# Altium schematic sheet Buttons.SchDoc
size A4; SheetNumber: 2; SheetTotal: 2
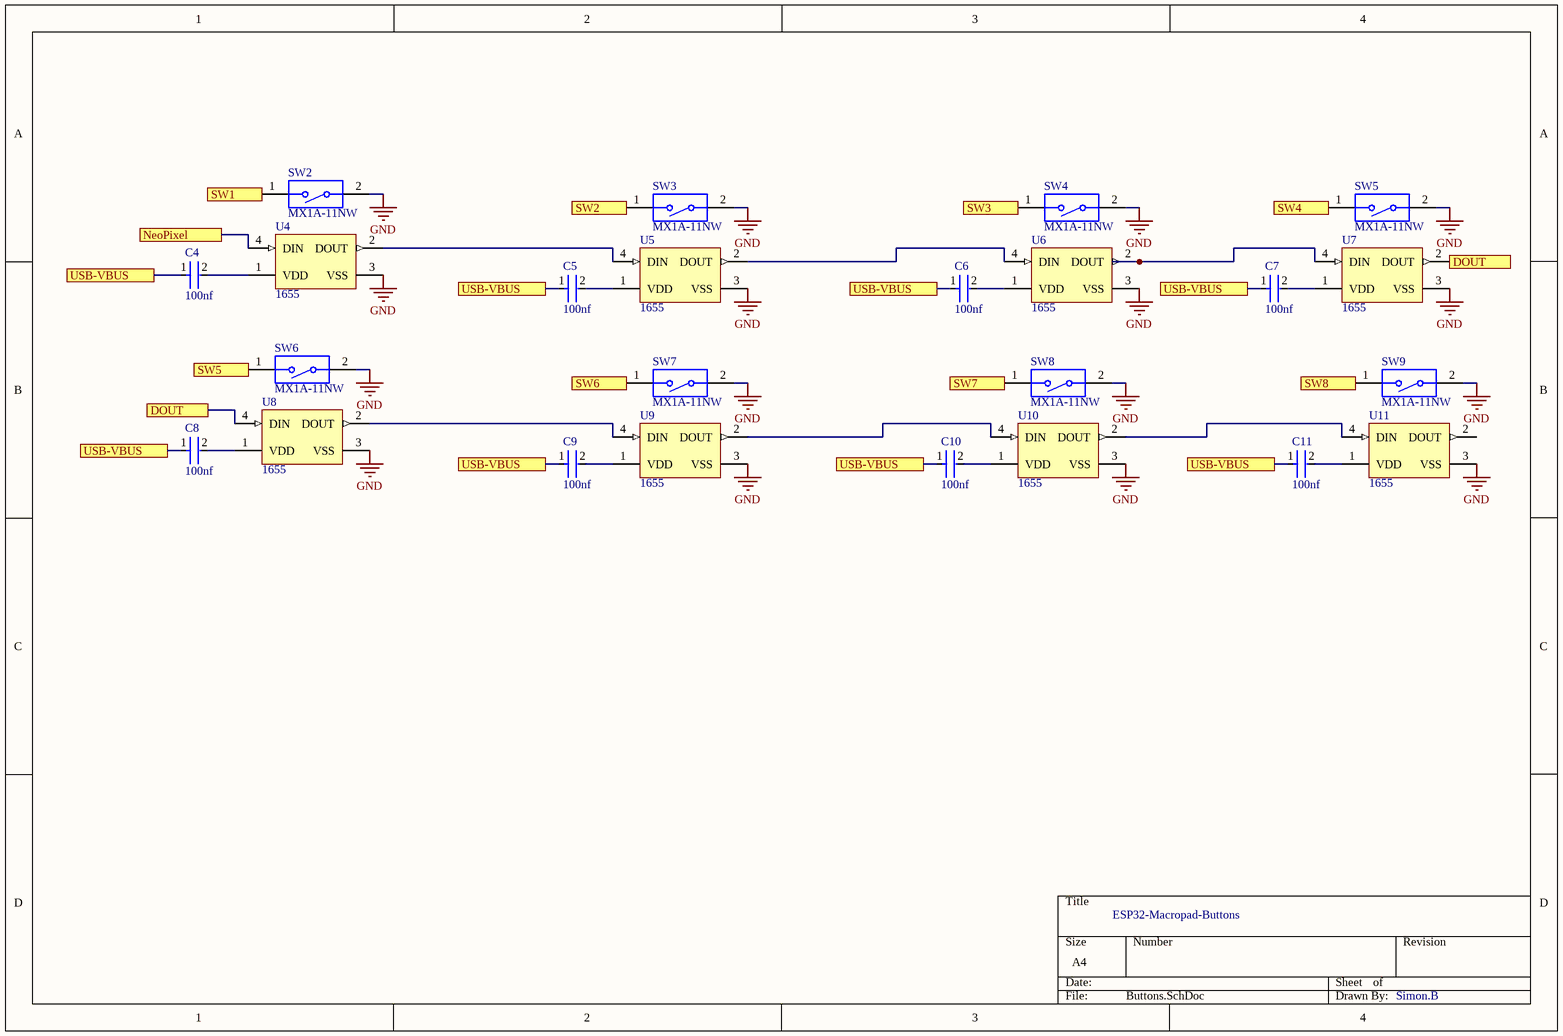
[diagram p0: Buttons.SchDoc]

## Parts
C4  100nf  [FP-CGA3E-0_3-0_1-IPC_A]
C5  100nf  [FP-CGA3E-0_3-0_1-IPC_A]
C6  100nf  [FP-CGA3E-0_3-0_1-IPC_A]
C7  100nf  [FP-CGA3E-0_3-0_1-IPC_A]
C8  100nf  [FP-CGA3E-0_3-0_1-IPC_A]
C9  100nf  [FP-CGA3E-0_3-0_1-IPC_A]
C10  100nf  [FP-CGA3E-0_3-0_1-IPC_A]
C11  100nf  [FP-CGA3E-0_3-0_1-IPC_A]
SW2  MX1A-11NW  [CHRY-MX1A-11NW_V]
SW3  MX1A-11NW  [CHRY-MX1A-11NW_V]
SW4  MX1A-11NW  [CHRY-MX1A-11NW_V]
SW5  MX1A-11NW  [CHRY-MX1A-11NW_V]
SW6  MX1A-11NW  [CHRY-MX1A-11NW_V]
SW7  MX1A-11NW  [CHRY-MX1A-11NW_V]
SW8  MX1A-11NW  [CHRY-MX1A-11NW_V]
SW9  MX1A-11NW  [CHRY-MX1A-11NW_V]
U4  1655  [ADA-RGB-1655_V]
U5  1655  [ADA-RGB-1655_V]
U6  1655  [ADA-RGB-1655_V]
U7  1655  [ADA-RGB-1655_V]
U8  1655  [ADA-RGB-1655_V]
U9  1655  [ADA-RGB-1655_V]
U10  1655  [ADA-RGB-1655_V]
U11  1655  [ADA-RGB-1655_V]

## Ports
DOUT, NeoPixel, SW1, SW2, SW3, SW4, SW5, SW6, SW7, SW8, USB-VBUS

## Nets
GND: SW2.2 SW3.2 SW4.2 SW5.2 SW6.2 SW7.2 SW8.2 SW9.2 U4.3(VSS) U5.3(VSS) U6.3(VSS) U7.3(VSS) U8.3(VSS) U9.3(VSS) U10.3(VSS) U11.3(VSS)
DOUT: U7.2(DOUT) U8.4(DIN) ; port DOUT
NeoPixel: U4.4(DIN) ; port NeoPixel
SW1: SW2.1 ; port SW1
SW2: SW3.1 ; port SW2
SW3: SW4.1 ; port SW3
SW4: SW5.1 ; port SW4
SW5: SW6.1 ; port SW5
SW6: SW7.1 ; port SW6
SW7: SW8.1 ; port SW7
SW8: SW9.1 ; port SW8
USB-VBUS: C4.1 C5.1 C6.1 C7.1 C8.1 C9.1 C10.1 C11.1 ; port USB-VBUS
NetC4_2: C4.2 U4.1(VDD)
NetC5_2: C5.2 U5.1(VDD)
NetC6_2: C6.2 U6.1(VDD)
NetC7_2: C7.2 U7.1(VDD)
NetC8_2: C8.2 U8.1(VDD)
NetC9_2: C9.2 U9.1(VDD)
NetC10_2: C10.2 U10.1(VDD)
NetC11_2: C11.2 U11.1(VDD)
NetU4_2: U4.2(DOUT) U5.4(DIN)
NetU5_2: U5.2(DOUT) U6.4(DIN)
NetU6_2: U6.2(DOUT) U7.4(DIN)
NetU8_2: U8.2(DOUT) U9.4(DIN)
NetU9_2: U9.2(DOUT) U10.4(DIN)
NetU10_2: U10.2(DOUT) U11.4(DIN)

Not connected (* = marked no-connect by the designer): U11 2(DOUT)

## Notes on the sheet
- ESP32-Macropad-Buttons
- Simon.B

## Library data of the parts
C4-C11 = CMP-08246-001708-1: Cap Ceramic 100nF 50V X7R 20% Pad SMD 0603 +125°C Automotive T/R; Voltage Rating: 50V; Width: 0.031inch; Height: 0.8mm; Capacitance: 100nF; Case Code (Metric): 1608; Packaging: Tape and Reel; Mount: Surface Mount; Weight: 7.1E-05oz; Max Operating Temperature: 125°C; Min Operating Temperature: -55°C; Voltage Rating (DC): 50V; Ratings: AEC-Q200; Dielectric: X7R; Case Code (Imperial): 0603; Package Quantity: 4000; Length: 0.063inch; Tolerance: 20%; Thickness: 0.031inch; Case/Package: 0603
SW2-SW9 = CMP-2000-06786-1: Keylock Switch, 12 V, -10 to 70 degC, 2-Pin THD, RoHS, Bulk; Manufacturer: Cherry; Part No: MX1A11NW; Maximum DC Voltage Rating: 12V; COO: UK; Row Spacing: 6.35mm; Pole Throw Configuration: SPST; Total Travel: 4.06mm; Illumination Type: N/R; Actuator Style: Button; Operating Force: 0.58N; Electrical Life: 50000000Cycle; Minimum Insulation Resistance: 100MOhm; Body Orientation: Straight; Actuator Length: 3.6mm; Switch Configuration: N.O.; Maximum Current Rating: 0.01A; Maximum Contact Resistance: 200mOhm; Actuator Color: N/A; Terminal Type: PCPins; Operating Temperature: -10to70C; Number of Terminals: 2; Operating Speed: N/A; Maximum AC Voltage Rating: 12V; Housing Material: N/A; Datasheet URL: https://cdn.sparkfun.com/datasheets/Components/Switches/MX%20Series.pdf; Type: DesktopProfile; Terminal Pitch: 2.54mm; Package Reference: MX1A-11NW; ECCN: EAR99; Family: MX; Packaging: N/A; HTS: 8536509065; Actuator Material: N/A; Package Description: 2-Pin Through Hole Device, Body 15.6 x 15.6 mm; Dielectric Strength: N/A; Illumination Color: N/R; Manufacturer URL: http://cherryswitches.com/cn/; Dimension: 15.6x15.6x15.2mm; Mechanical Life: N/A; RoHS: Unknown; Contact Plating: N/A; Supplier: CherryElectrical; Contact Material: Silver/Gold; IP Rating: N/A; Mounting: ThroughHole; Datasheet Version: 09/2000; Maximum Power Rating: N/A; Mounting Technology: ThroughHole
U4-U11 = CMP-2000-05026-1: Intelligent Control LED Integrated Light Source, 3.5 to 5.3 V, -25 to 80 degC, 4-Pin SMD, RoHS, Tape and Reel; Manufacturer: Adafruit-Industries-LLC; Number of LEDs: 10; Configuration: Discrete; Utilized LED: WS2812(5050); Datasheet URL: http://datasheet.octopart.com/ADA1655-Adafruit-Industries-datasheet-32028139.pdf; Series: Neopixel; Interface: -; Package Description: 4-Pin Surface Mount Device, Body 5 x 5 mm; Color: Red,Green,Blue(RGB); Category: Optoelectronics; Controller Type: -; Package Reference: 1655; Manufacturer URL: https://www.adafruit.com/; Mounting Type: SurfaceMount; Datasheet Version: May-13; Size / Dimension: 5.00mmLx5.00mmW; Family: Addressable,Specialty